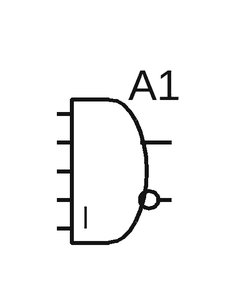
[diagram p0: schematic Draft1.asc]
Draft1.asc, the LTspice schematic file:
Version 4
SHEET 1 880 680
SYMBOL Digital\\and 160 96 R0
SYMATTR InstName A1

The netlist it stands for:
* Draft1.asc
A1 0 0 0 0 0 0 0 0 AND
.backanno
.end